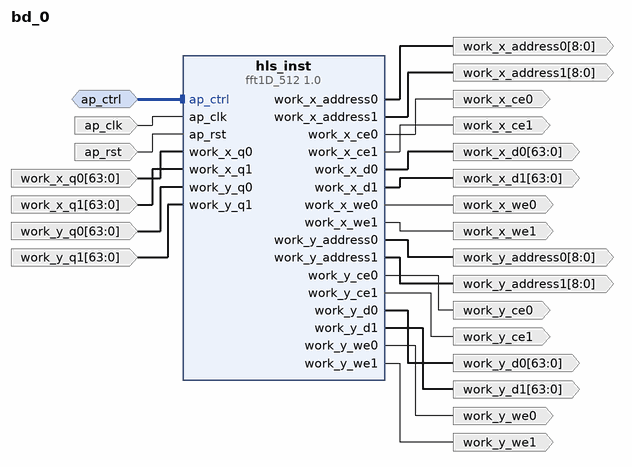
[diagram p0: block diagram of the top level]
# Vivado block design bd_0, xcu50-fsvh2104-2-e, Vivado 2023.2
create_bd_design bd_0

create_bd_intf_port -mode Slave -vlnv xilinx.com:interface:acc_handshake_rtl:1.0 ap_ctrl
create_bd_port -dir I -type clk ap_clk
set_property -dict {CONFIG.FREQ_HZ 125000000.0} [get_bd_ports ap_clk]
create_bd_port -dir I -type rst ap_rst
set_property -dict {CONFIG.POLARITY ACTIVE_HIGH} [get_bd_ports ap_rst]
create_bd_port -dir O -from 8 -to 0 -type data work_x_address0
create_bd_port -dir O -from 8 -to 0 -type data work_x_address1
create_bd_port -dir O work_x_ce0
create_bd_port -dir O work_x_ce1
create_bd_port -dir O -from 63 -to 0 -type data work_x_d0
create_bd_port -dir O -from 63 -to 0 -type data work_x_d1
create_bd_port -dir I -from 63 -to 0 -type data work_x_q0
create_bd_port -dir I -from 63 -to 0 -type data work_x_q1
create_bd_port -dir O work_x_we0
create_bd_port -dir O work_x_we1
create_bd_port -dir O -from 8 -to 0 -type data work_y_address0
create_bd_port -dir O -from 8 -to 0 -type data work_y_address1
create_bd_port -dir O work_y_ce0
create_bd_port -dir O work_y_ce1
create_bd_port -dir O -from 63 -to 0 -type data work_y_d0
create_bd_port -dir O -from 63 -to 0 -type data work_y_d1
create_bd_port -dir I -from 63 -to 0 -type data work_y_q0
create_bd_port -dir I -from 63 -to 0 -type data work_y_q1
create_bd_port -dir O work_y_we0
create_bd_port -dir O work_y_we1

create_bd_cell -type ip -vlnv xilinx.com:hls:fft1D_512:1.0 hls_inst

# ---- connections ----

connect_bd_intf_net -intf_net ap_ctrl_0_1 [get_bd_intf_ports ap_ctrl] [get_bd_intf_pins hls_inst/ap_ctrl]
connect_bd_net -net ap_clk_0_1 [get_bd_ports ap_clk] [get_bd_pins hls_inst/ap_clk]
connect_bd_net -net ap_rst_0_1 [get_bd_ports ap_rst] [get_bd_pins hls_inst/ap_rst]
connect_bd_net [get_bd_pins hls_inst/work_x_address0] [get_bd_ports work_x_address0]
connect_bd_net [get_bd_pins hls_inst/work_x_address1] [get_bd_ports work_x_address1]
connect_bd_net [get_bd_pins hls_inst/work_x_ce0] [get_bd_ports work_x_ce0]
connect_bd_net [get_bd_pins hls_inst/work_x_ce1] [get_bd_ports work_x_ce1]
connect_bd_net [get_bd_pins hls_inst/work_x_d0] [get_bd_ports work_x_d0]
connect_bd_net [get_bd_pins hls_inst/work_x_d1] [get_bd_ports work_x_d1]
connect_bd_net [get_bd_pins hls_inst/work_x_we0] [get_bd_ports work_x_we0]
connect_bd_net [get_bd_pins hls_inst/work_x_we1] [get_bd_ports work_x_we1]
connect_bd_net [get_bd_pins hls_inst/work_y_address0] [get_bd_ports work_y_address0]
connect_bd_net [get_bd_pins hls_inst/work_y_address1] [get_bd_ports work_y_address1]
connect_bd_net [get_bd_pins hls_inst/work_y_ce0] [get_bd_ports work_y_ce0]
connect_bd_net [get_bd_pins hls_inst/work_y_ce1] [get_bd_ports work_y_ce1]
connect_bd_net [get_bd_pins hls_inst/work_y_d0] [get_bd_ports work_y_d0]
connect_bd_net [get_bd_pins hls_inst/work_y_d1] [get_bd_ports work_y_d1]
connect_bd_net [get_bd_pins hls_inst/work_y_we0] [get_bd_ports work_y_we0]
connect_bd_net [get_bd_pins hls_inst/work_y_we1] [get_bd_ports work_y_we1]
connect_bd_net -net work_x_q0_0_1 [get_bd_ports work_x_q0] [get_bd_pins hls_inst/work_x_q0]
connect_bd_net -net work_x_q1_0_1 [get_bd_ports work_x_q1] [get_bd_pins hls_inst/work_x_q1]
connect_bd_net -net work_y_q0_0_1 [get_bd_ports work_y_q0] [get_bd_pins hls_inst/work_y_q0]
connect_bd_net -net work_y_q1_0_1 [get_bd_ports work_y_q1] [get_bd_pins hls_inst/work_y_q1]

validate_bd_design
save_bd_design
